# EAGLE schematic Master Schematic_2.0_DRAFT (EAGLE 9.3.2)

## Sheet 1 of 2
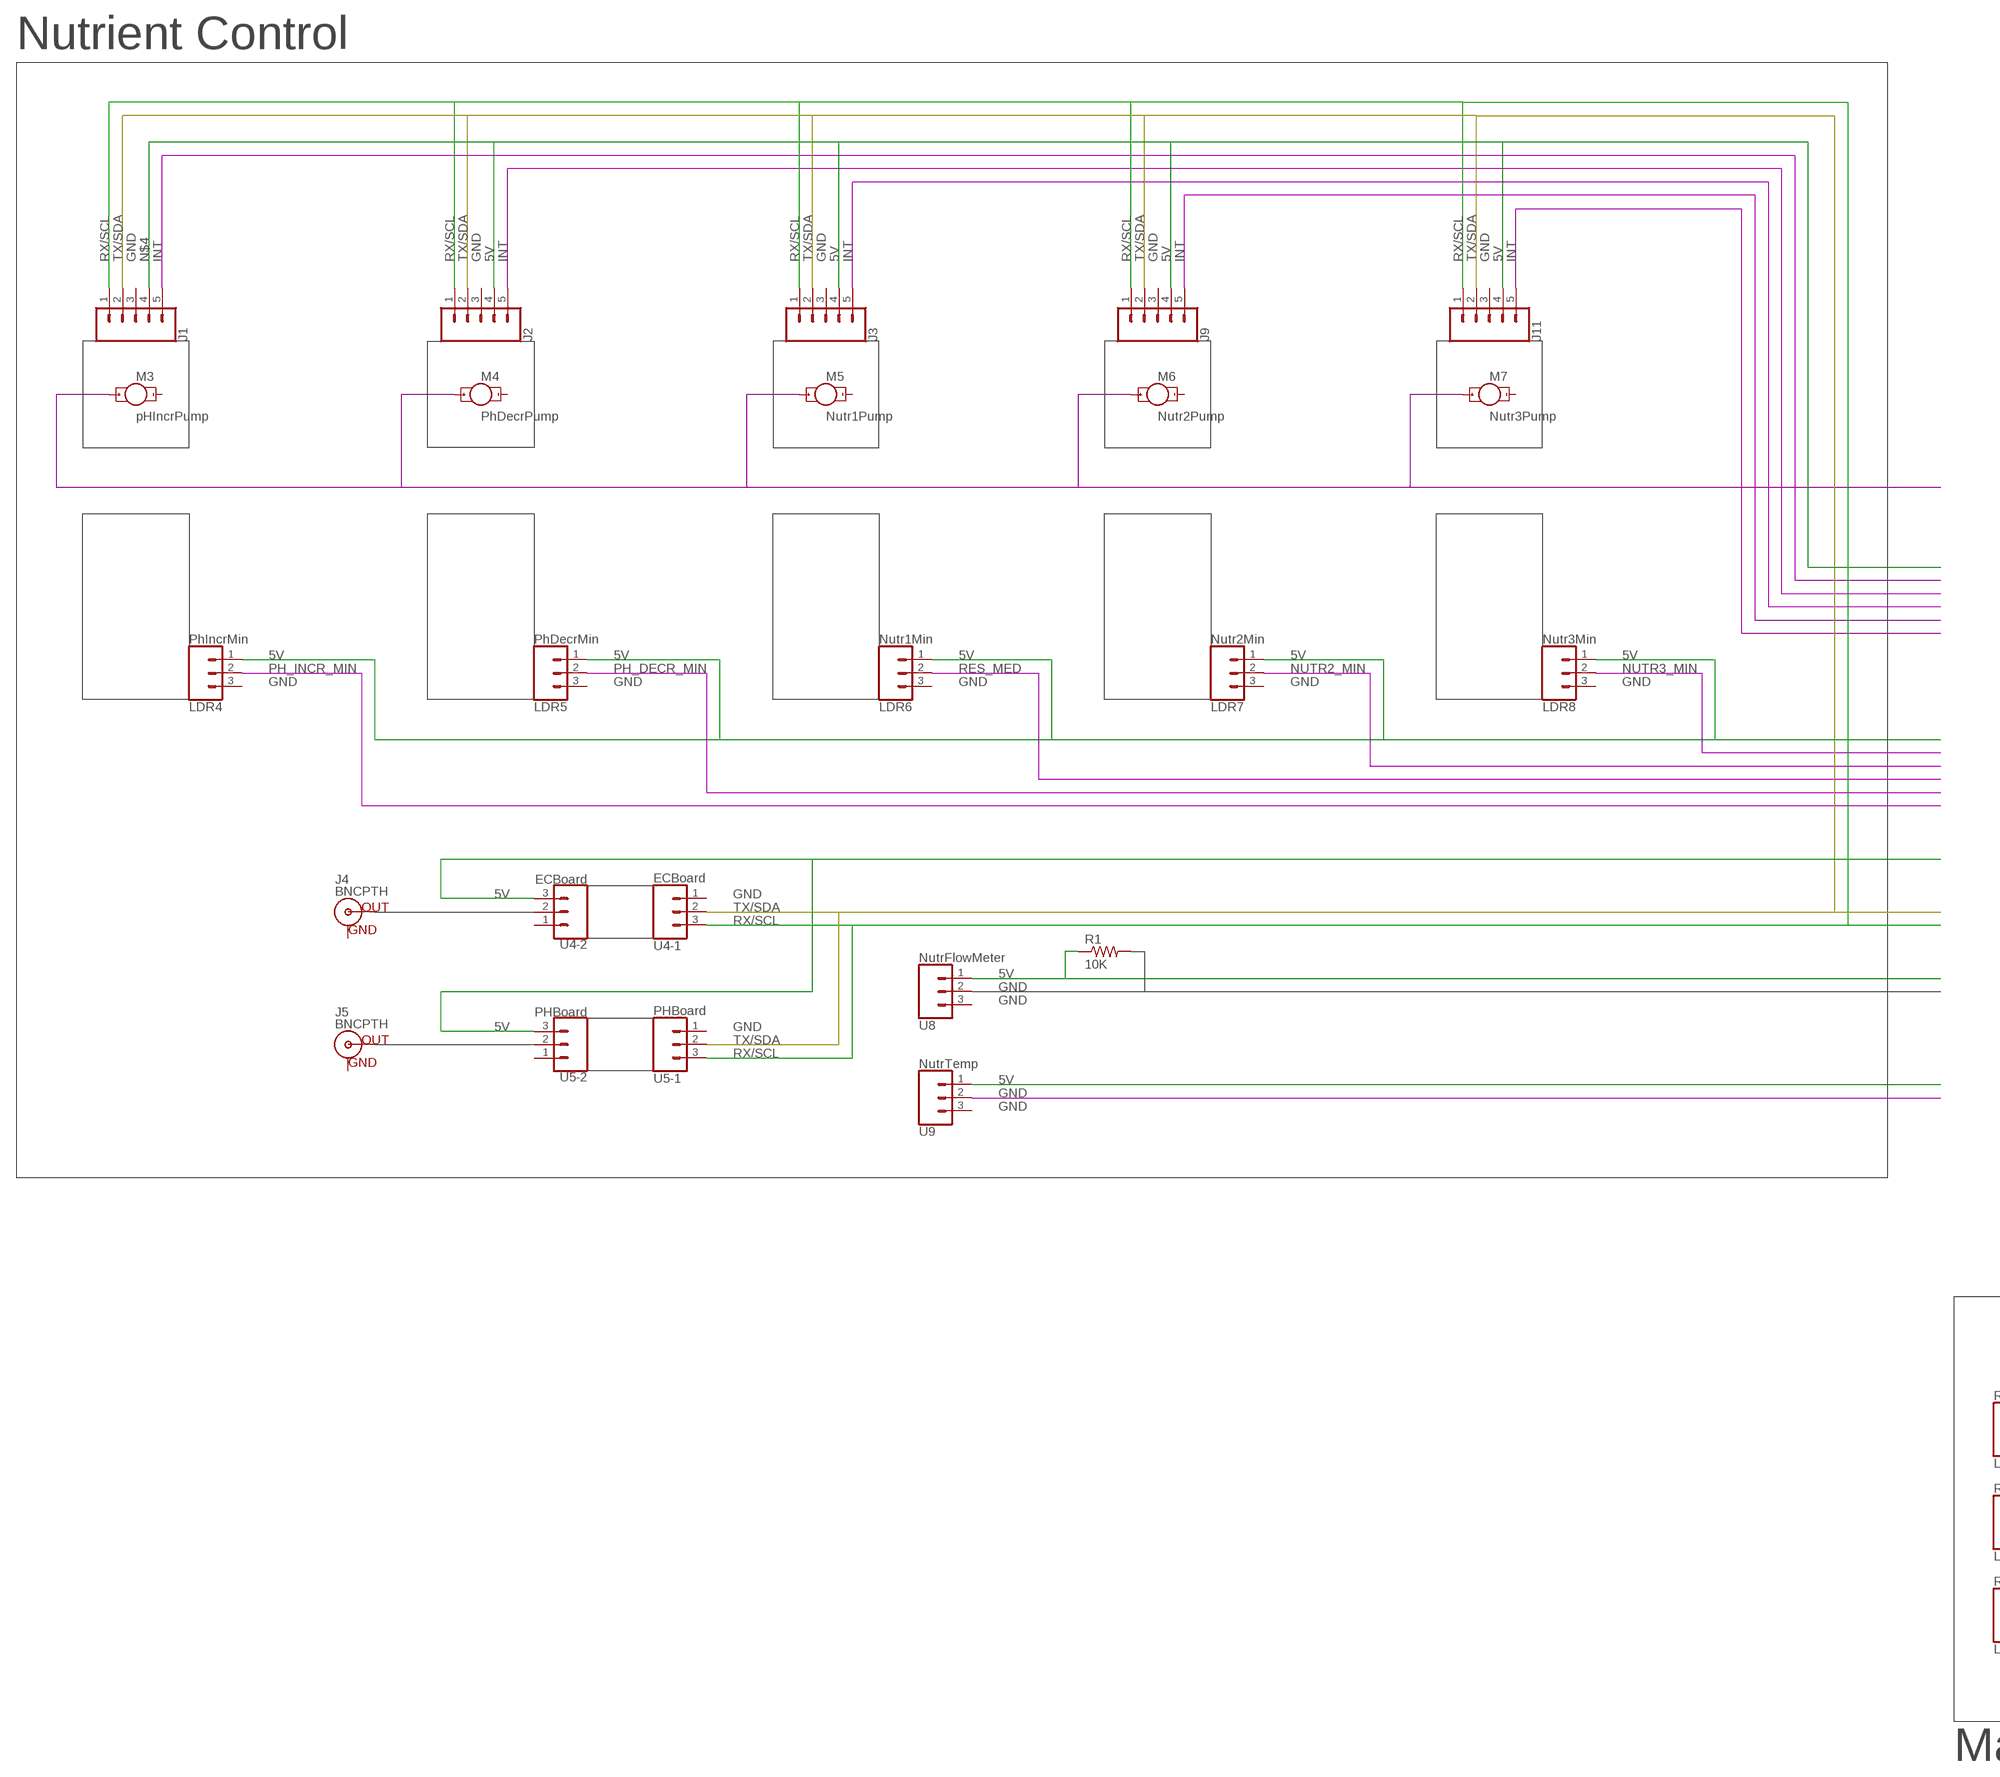
[diagram p0: schematic, sheet 1, part 1 of 2]
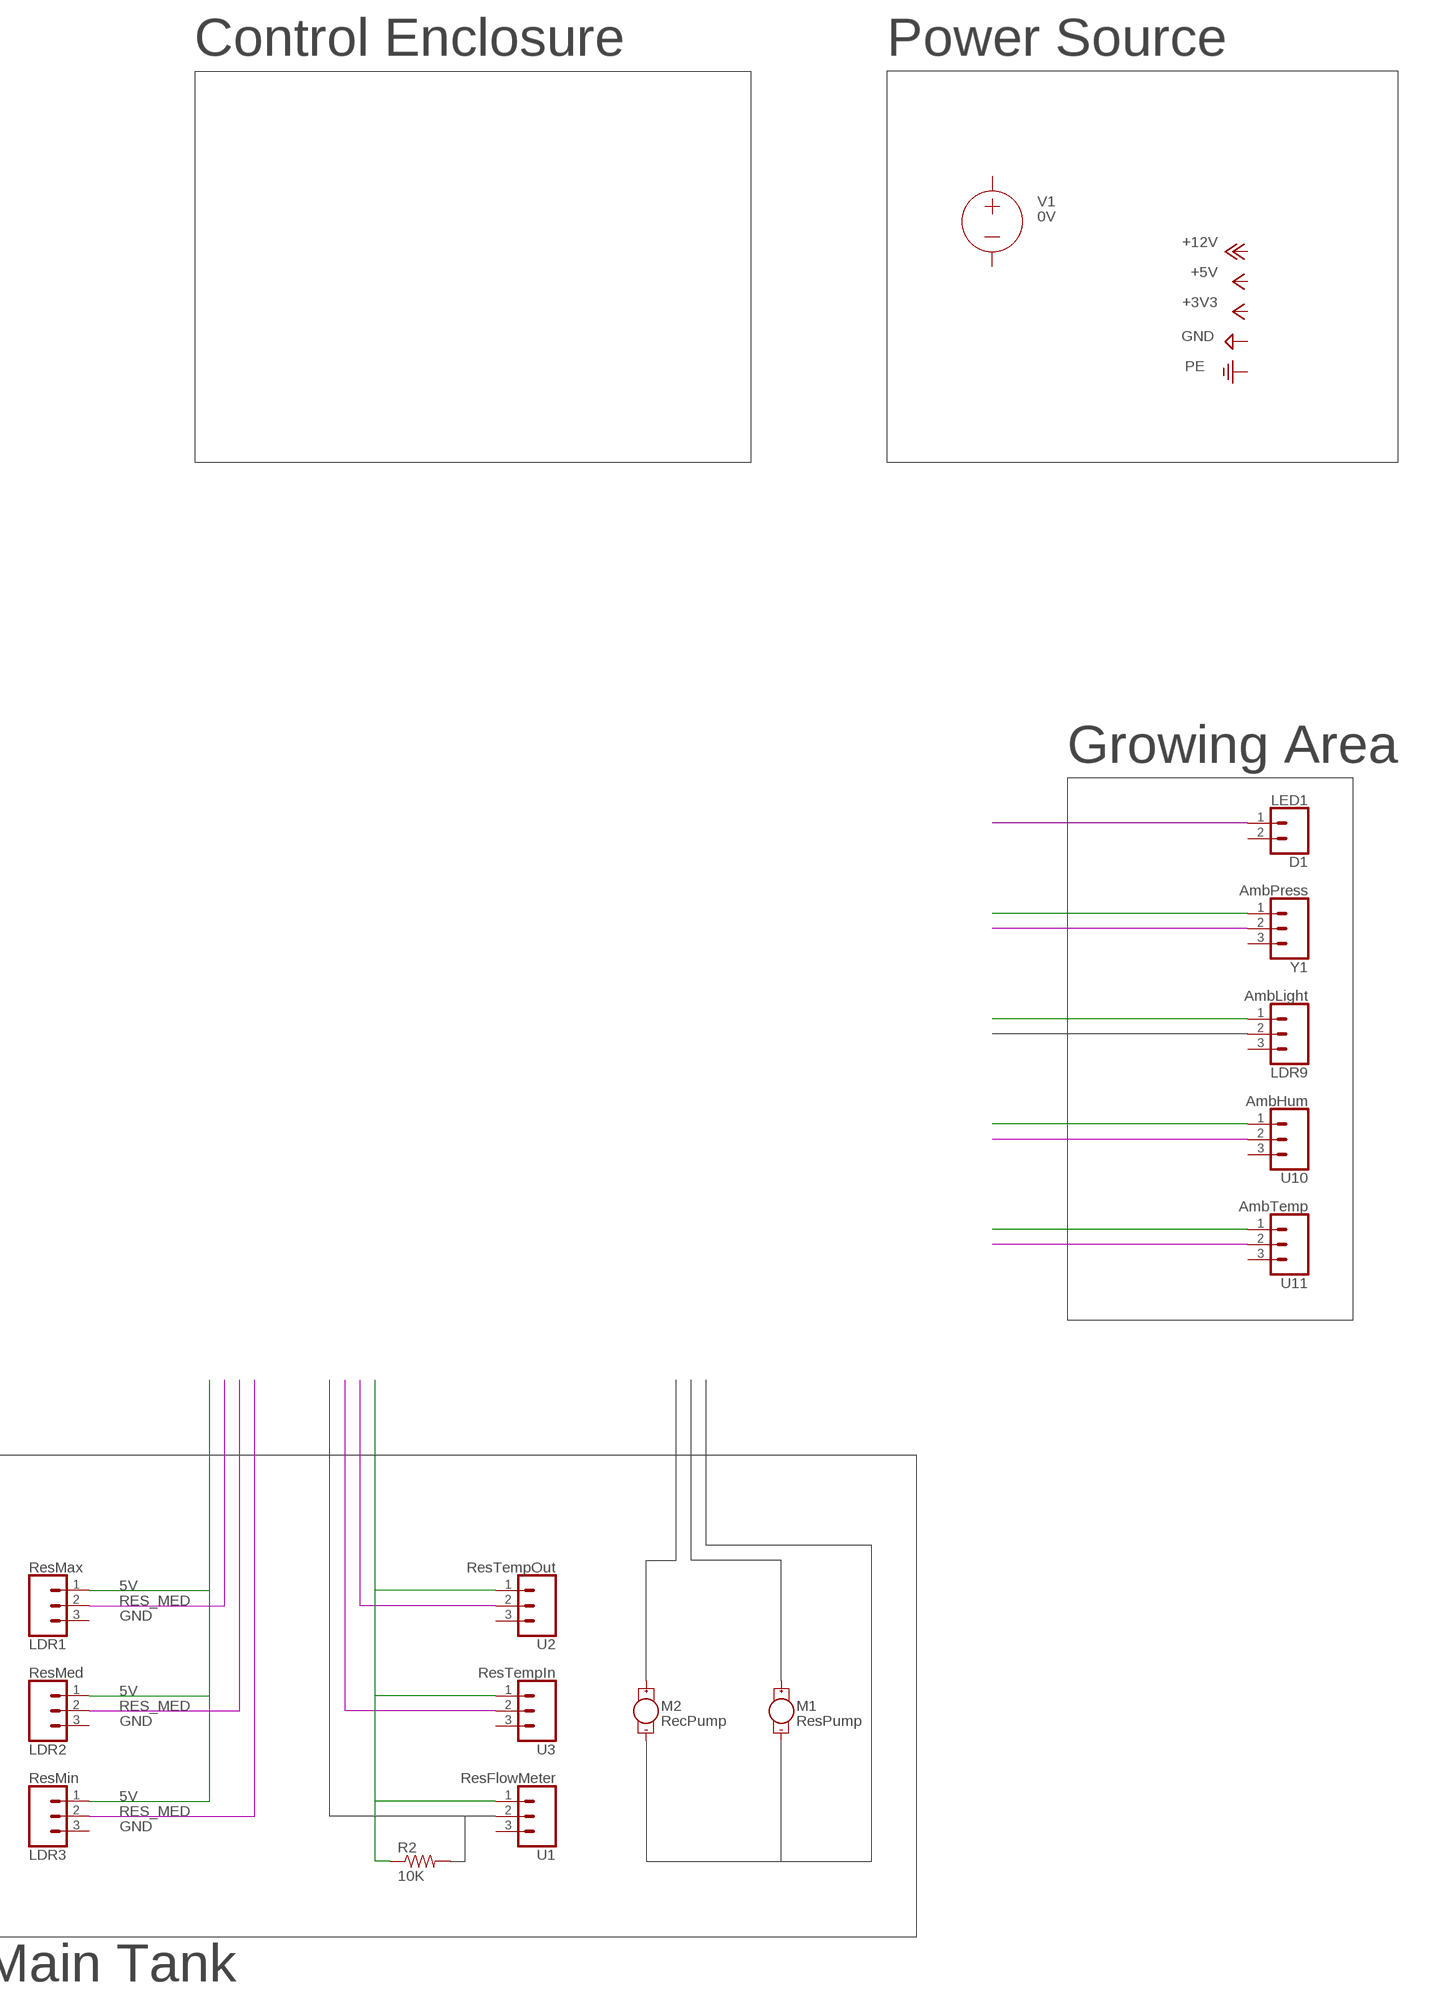
[diagram p1: schematic, sheet 1, part 2 of 2]

### Parts
D1  LED1  CONN_02  [1X02]
J1  CONN_05  [1X05]
J2  CONN_05  [1X05]
J3  CONN_05  [1X05]
J4  BNCPTH  [BNC]
J5  BNCPTH  [BNC]
J9  CONN_05  [1X05]
J11  CONN_05  [1X05]
LDR1  ResMax  CONN_03  [1X03]
LDR2  ResMed  CONN_03  [1X03]
LDR3  ResMin  CONN_03  [1X03]
LDR4  PhIncrMin  CONN_03  [1X03]
LDR5  PhDecrMin  CONN_03  [1X03]
LDR6  Nutr1Min  CONN_03  [1X03]
LDR7  Nutr2Min  CONN_03  [1X03]
LDR8  Nutr3Min  CONN_03  [1X03]
LDR9  AmbLight  CONN_03  [1X03]
M1  ResPump  MOTOR10MM  [VIBE-MOTOR-10MM]
M2  RecPump  MOTOR10MM  [VIBE-MOTOR-10MM]
M3  pHIncrPump  MOTOR10MM  [VIBE-MOTOR-10MM]
M4  PhDecrPump  MOTOR10MM  [VIBE-MOTOR-10MM]
M5  Nutr1Pump  MOTOR10MM  [VIBE-MOTOR-10MM]
M6  Nutr2Pump  MOTOR10MM  [VIBE-MOTOR-10MM]
M7  Nutr3Pump  MOTOR10MM  [VIBE-MOTOR-10MM]
R1  10K  R-US_0204/5  [0204/5]
R2  10K  R-US_0204/5  [0204/5]
U1  ResFlowMeter  CONN_03  [1X03]
U2  ResTempOut  CONN_03  [1X03]
U3  ResTempIn  CONN_03  [1X03]
U4-1  ECBoard  CONN_03  [1X03]
U4-2  ECBoard  CONN_03  [1X03]
U5-1  PHBoard  CONN_03  [1X03]
U5-2  PHBoard  CONN_03  [1X03]
U8  NutrFlowMeter  CONN_03  [1X03]
U9  NutrTemp  CONN_03  [1X03]
U10  AmbHum  CONN_03  [1X03]
U11  AmbTemp  CONN_03  [1X03]
V1  0V  VOLTAGE  (no package)
Y1  AmbPress  CONN_03  [1X03]

### Nets
5V: LDR1.1 LDR2.1 LDR3.1 LDR4.1 LDR5.1 LDR6.1 LDR7.1 LDR8.1 U4-2.3 U5-2.3
N$1: R2.1 U1.1 U2.1 U3.1
N$2 [GND]: R1.1 U8.1
N$3 [GND]: U9.1
N$4: J1.4
N$5: J2.4
N$6: J3.4
N$7: J9.4
N$8: J11.4
N$9: Y1.1
N$10: LDR9.1
N$11: U10.1
N$12: U11.1
Unconnected: D1.1 D1.2 J1.1 J1.2 J1.3 J1.5 J2.1 J2.2 J2.3 J2.5 J3.1 J3.2 J3.3 J3.5 J4.GND J4.S(OUT) J5.GND J5.S(OUT) J9.1 J9.2 J9.3 J9.5 J11.1 J11.2 J11.3 J11.5 LDR1.2 LDR1.3 LDR2.2 LDR2.3 LDR3.2 LDR3.3 LDR4.2 LDR4.3 LDR5.2 LDR5.3 LDR6.2 LDR6.3 LDR7.2 LDR7.3 LDR8.2 LDR8.3 LDR9.2 LDR9.3 M1.+ M1.- M2.+ M2.- M3.+ M3.- M4.+ M4.- M5.+ M5.- M6.+ M6.- M7.+ M7.- R1.2 R2.2 U1.2 U1.3 U2.2 U2.3 U3.2 U3.3 U4-1.1 U4-1.2 U4-1.3 U4-2.1 U4-2.2 U5-1.1 U5-1.2 U5-1.3 U5-2.1 U5-2.2 U8.2 U8.3 U9.2 U9.3 U10.2 U10.3 U11.2 U11.3 V1.+ V1.- Y1.2 Y1.3

### Notes on the sheet
- Nutrient Control | Control Enclosure | Power Source
- Growing Area
- Main Tank

## Sheet 2 of 2
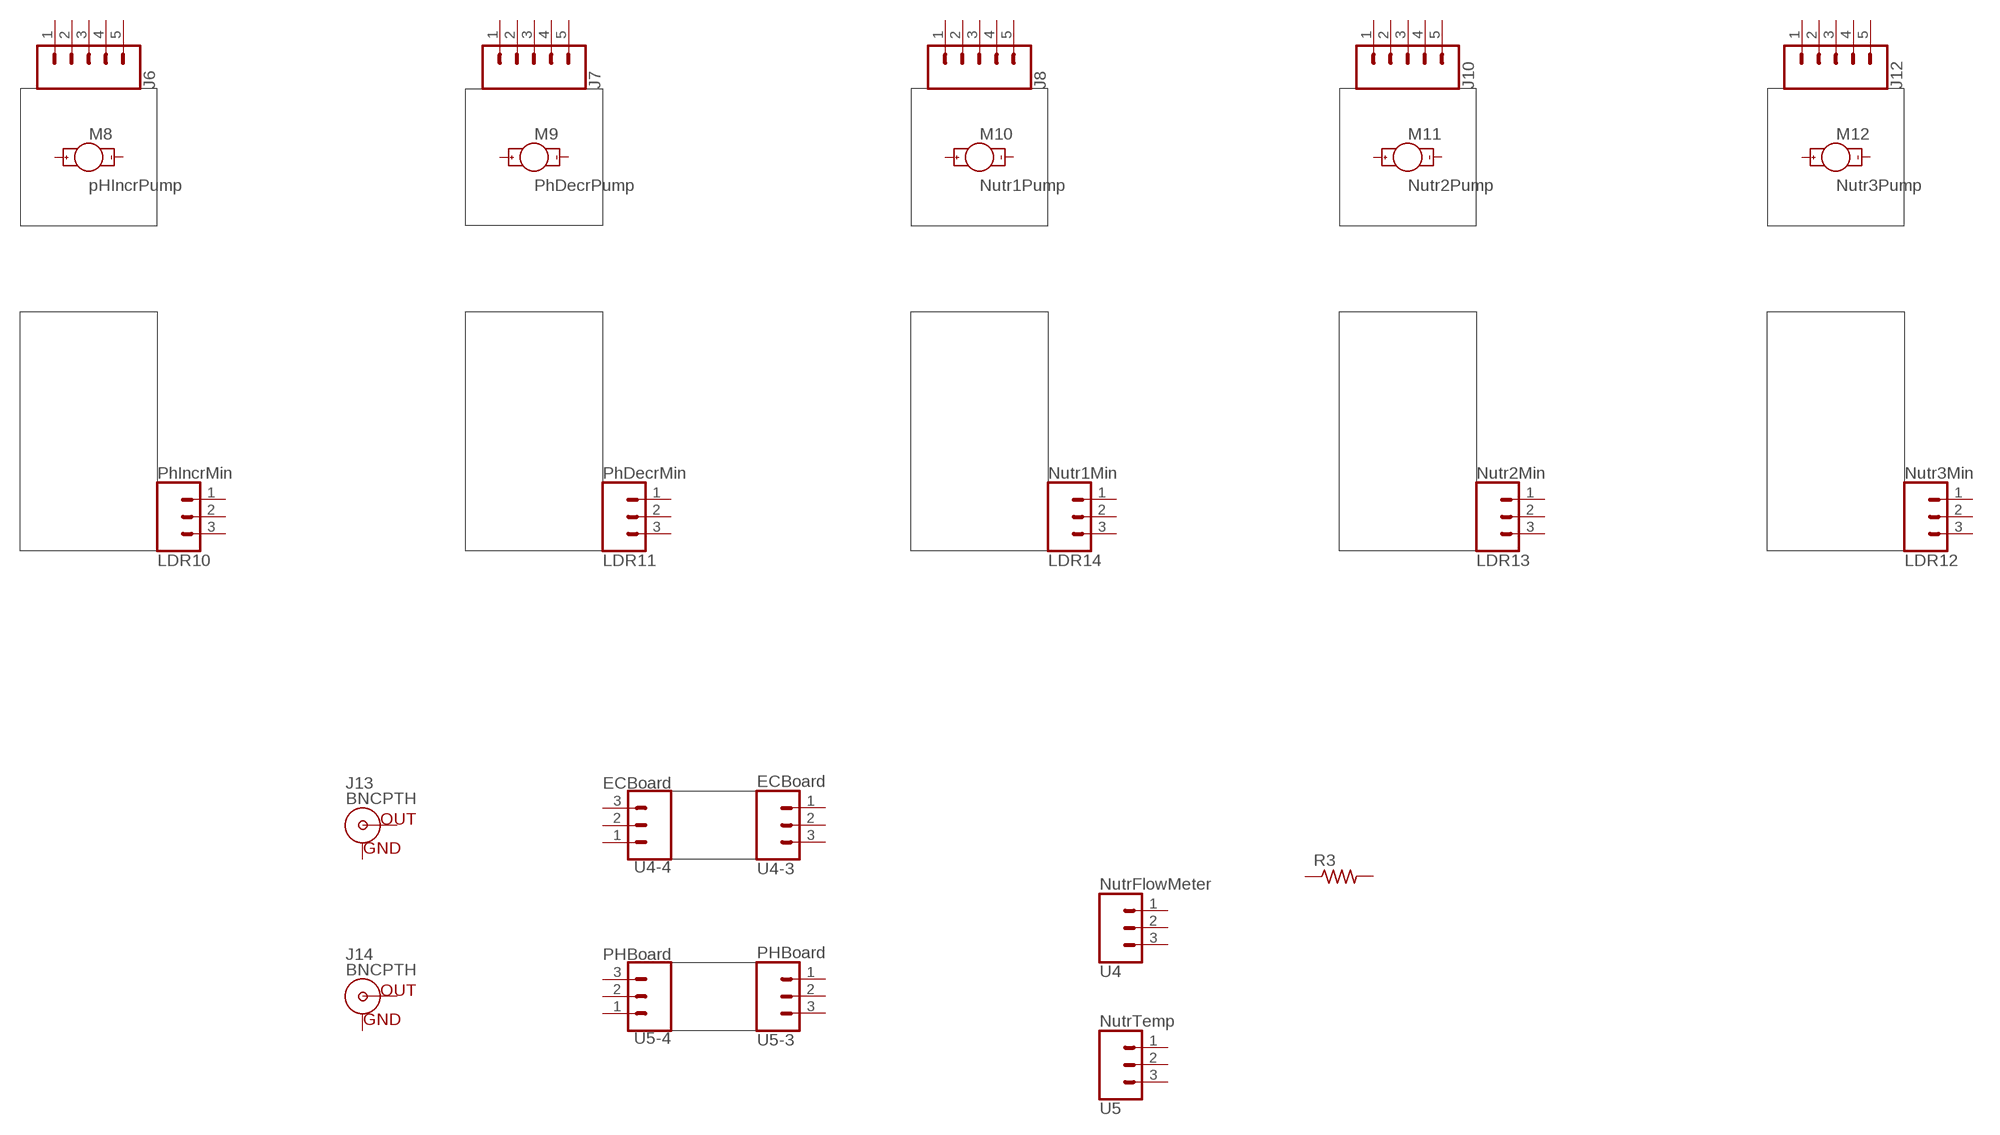
[diagram p2: schematic, sheet 2]

### Parts
J6  CONN_05  [1X05]
J7  CONN_05  [1X05]
J8  CONN_05  [1X05]
J10  CONN_05  [1X05]
J12  CONN_05  [1X05]
J13  BNCPTH  [BNC]
J14  BNCPTH  [BNC]
LDR10  PhIncrMin  CONN_03  [1X03]
LDR11  PhDecrMin  CONN_03  [1X03]
LDR12  Nutr3Min  CONN_03  [1X03]
LDR13  Nutr2Min  CONN_03  [1X03]
LDR14  Nutr1Min  CONN_03  [1X03]
M8  pHIncrPump  MOTOR10MM  [VIBE-MOTOR-10MM]
M9  PhDecrPump  MOTOR10MM  [VIBE-MOTOR-10MM]
M10  Nutr1Pump  MOTOR10MM  [VIBE-MOTOR-10MM]
M11  Nutr2Pump  MOTOR10MM  [VIBE-MOTOR-10MM]
M12  Nutr3Pump  MOTOR10MM  [VIBE-MOTOR-10MM]
R3  10K  R-US_0204/5  [0204/5]
U4  NutrFlowMeter  CONN_03  [1X03]
U4-3  ECBoard  CONN_03  [1X03]
U4-4  ECBoard  CONN_03  [1X03]
U5  NutrTemp  CONN_03  [1X03]
U5-3  PHBoard  CONN_03  [1X03]
U5-4  PHBoard  CONN_03  [1X03]
Unconnected: J6.1 J6.2 J6.3 J6.4 J6.5 J7.1 J7.2 J7.3 J7.4 J7.5 J8.1 J8.2 J8.3 J8.4 J8.5 J10.1 J10.2 J10.3 J10.4 J10.5 J12.1 J12.2 J12.3 J12.4 J12.5 J13.GND J13.S(OUT) J14.GND J14.S(OUT) LDR10.1 LDR10.2 LDR10.3 LDR11.1 LDR11.2 LDR11.3 LDR12.1 LDR12.2 LDR12.3 LDR13.1 LDR13.2 LDR13.3 LDR14.1 LDR14.2 LDR14.3 M8.+ M8.- M9.+ M9.- M10.+ M10.- M11.+ M11.- M12.+ M12.- R3.1 R3.2 U4-3.1 U4-3.2 U4-3.3 U4-4.1 U4-4.2 U4-4.3 U4.1 U4.2 U4.3 U5-3.1 U5-3.2 U5-3.3 U5-4.1 U5-4.2 U5-4.3 U5.1 U5.2 U5.3

## Library data of the parts
D1 = SparkFun-Connectors:CONN_02: Multi connection point. Often used as Generic Header-pin footprint for 0.1 inch spaced/style header connections On any of the 0.1 inch spaced packages, you can populate with these: Break Away Headers - Straight <https://www.sparkfun.com/products/116> (PRT-00116) Break Away Male Headers - Right Angle <https://www.sparkfun.com/products/553> (PRT-00553) Female Headers <https://www.sparkfun.com/products/115> (PRT-00115) Break Away Headers - Machine Pin <https://www.sparkfun.com/products/117> (PRT-00117) Break Away Female Headers - Swiss Machine Pin <https://www.sparkfun.com/products/743> (PRT-00743) For SCREWTERMINALS and SPRING TERMINALS visit here: Screw Terimnals on SparkFun.com <https://www.sparkfun.com/search/results?term=Screw+Terminals> (5mm/3.5mm/2.54mm spacing) This device is also useful as a general connection point to wire up your design to another part of your project. Our various solder wires solder well into these plated through hole pads. Hook-Up Wire - Assortment (Stranded, 22 AWG) <https://www.sparkfun.com/products/11375> (PRT-11375) Hook-Up Wire - Assortment (Solid Core, 22 AWG) <https://www.sparkfun.com/products/11367> (PRT-11367) View the entire wire category on our website here <https://www.sparkfun.com/categories/141> Special notes: Molex polarized connector foot print use with: PRT-08233 with associated crimp pins and housings. 2.54_SCREWTERM for use with PRT-10571. 3.5mm Screw Terminal footprints for PRT-08084 5mm Screw Terminal footprints for use with PRT-08432
J1-J3 J6-J12 = SparkFun-Connectors:CONN_05: Multi connection point. Often used as Generic Header-pin footprint for 0.1 inch spaced/style header connections On any of the 0.1 inch spaced packages, you can populate with these: Break Away Headers - Straight <https://www.sparkfun.com/products/116> (PRT-00116) Break Away Male Headers - Right Angle <https://www.sparkfun.com/products/553> (PRT-00553) Female Headers <https://www.sparkfun.com/products/115> (PRT-00115) Break Away Headers - Machine Pin <https://www.sparkfun.com/products/117> (PRT-00117) Break Away Female Headers - Swiss Machine Pin <https://www.sparkfun.com/products/743> (PRT-00743) For SCREWTERMINALS and SPRING TERMINALS visit here: Screw Terimnals on SparkFun.com <https://www.sparkfun.com/search/results?term=Screw+Terminals> (5mm/3.5mm/2.54mm spacing) This device is also useful as a general connection point to wire up your design to another part of your project. Our various solder wires solder well into these plated through hole pads. Hook-Up Wire - Assortment (Stranded, 22 AWG) <https://www.sparkfun.com/products/11375> (PRT-11375) Hook-Up Wire - Assortment (Solid Core, 22 AWG) <https://www.sparkfun.com/products/11367> (PRT-11367) View the entire wire category on our website here <https://www.sparkfun.com/categories/141> Special notes: Molex polarized connector foot print use with SKU : PRT-08231 with associated crimp pins and housings. 1MM SMD Version SKU: PRT-10208
J4 J5 J13 J14 = SparkFun-Connectors:BNC: BNC Right Angle Connector Mouser Part# 5227161 SparkFun Products: BNC Connector - Right Angle <https://www.sparkfun.com/products/10550>; PROD_ID: LPA-12729; SF_ID: PRT-10550
LDR1-LDR14 U1-U4 U4-1-U4-4 U5 U5-1-U5-4 U8-U11 Y1 = SparkFun-Connectors:CONN_03: Multi connection point. Often used as Generic Header-pin footprint for 0.1 inch spaced/style header connections On any of the 0.1 inch spaced packages, you can populate with these: Break Away Headers - Straight <https://www.sparkfun.com/products/116> (PRT-00116) Break Away Male Headers - Right Angle <https://www.sparkfun.com/products/553> (PRT-00553) Female Headers <https://www.sparkfun.com/products/115> (PRT-00115) Break Away Headers - Machine Pin <https://www.sparkfun.com/products/117> (PRT-00117) Break Away Female Headers - Swiss Machine Pin <https://www.sparkfun.com/products/743> (PRT-00743) Stackable Header - 3 Pin (Female, 0.1") <https://www.sparkfun.com/products/13875> (PRT-13875) For SCREWTERMINALS and SPRING TERMINALS visit here: Screw Terimnals on SparkFun.com <https://www.sparkfun.com/search/results?term=Screw+Terminals> (5mm/3.5mm/2.54mm spacing) This device is also useful as a general connection point to wire up your design to another part of your project. Our various solder wires solder well into these plated through hole pads. Hook-Up Wire - Assortment (Stranded, 22 AWG) <https://www.sparkfun.com/products/11375> (PRT-11375) Hook-Up Wire - Assortment (Solid Core, 22 AWG) <https://www.sparkfun.com/products/11367> (PRT-11367) View the entire wire category on our website here <https://www.sparkfun.com/categories/141> Special notes: Molex polarized connector foot print use with SKU : PRT-08232 with associated crimp pins and housings.
M1-M12 = SparkFun-Electromechanical:MOTOR: Motor (Single-Phase) Two-terminal, single-phase motors. SparkFun Products Vibration Motor <https://www.sparkfun.com/products/8449> (ROB-08449) Physical dimension and wire connections for this powerful vibration motor. Motor has a self adhesive backing.; PROD_ID: COMP-08572; SF_SKU: ROB-08449
R1-R3 = adafruit:R-US_: RESISTOR, American symbol
V1 = ngspice-simulation:VOLTAGE: Independent Voltage Source, either DC, AC, PULSE, SINE, PWL, EXP, or SFFM